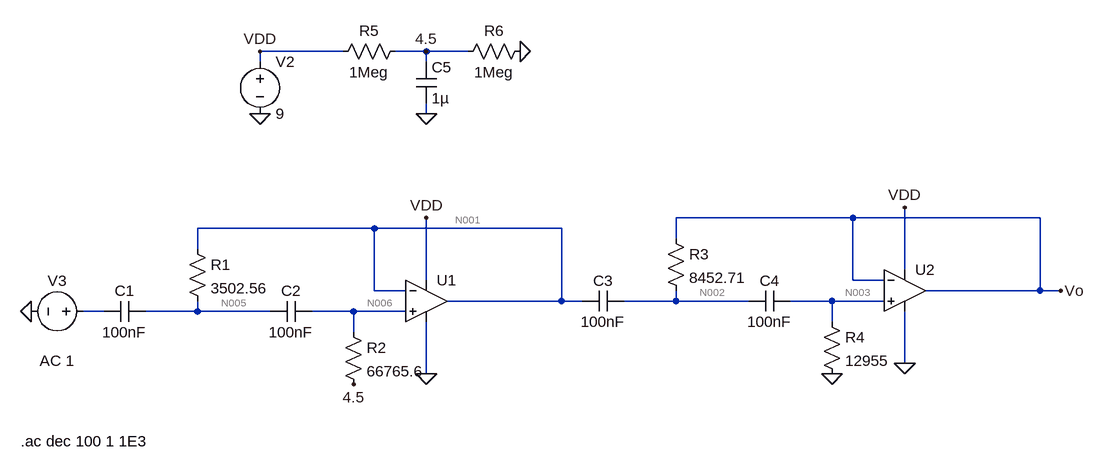
[diagram p0: schematic P1_409_Final.asc]
P1_409_Final.asc, the LTspice schematic file:
Version 4.1
SHEET 1 1188 680
WIRE -48 -240 -176 -240
WIRE 80 -240 32 -240
WIRE 144 -240 80 -240
WIRE -176 -224 -176 -240
WIRE 80 -224 80 -240
WIRE 80 -144 80 -160
WIRE 736 16 464 16
WIRE 1024 16 736 16
WIRE 0 32 -272 32
WIRE 288 32 0 32
WIRE 464 48 464 16
WIRE -272 64 -272 32
WIRE 816 96 816 0
WIRE 80 112 80 16
WIRE 736 112 736 16
WIRE 784 112 736 112
WIRE 0 128 0 32
WIRE 48 128 0 128
WIRE 1024 128 1024 16
WIRE 1024 128 848 128
WIRE 1056 128 1024 128
WIRE 288 144 288 32
WIRE 288 144 112 144
WIRE 320 144 288 144
WIRE 464 144 464 128
WIRE 464 144 384 144
WIRE 576 144 464 144
WIRE 704 144 640 144
WIRE 784 144 704 144
WIRE -416 160 -448 160
WIRE -272 160 -272 144
WIRE -272 160 -352 160
WIRE -160 160 -272 160
WIRE -32 160 -96 160
WIRE 48 160 -32 160
WIRE 704 176 704 144
WIRE -32 192 -32 160
WIRE 816 240 816 160
WIRE 80 256 80 176
FLAG -176 -144 0
FLAG -528 160 0
FLAG 816 240 0
FLAG 704 256 0
FLAG 80 256 0
FLAG 224 -240 0
FLAG 80 -144 0
FLAG 80 -240 4.5
FLAG -32 272 4.5
FLAG -176 -240 VDD
FLAG 80 16 VDD
FLAG 816 0 VDD
FLAG 1056 128 Vo
SYMBOL voltage -176 -240 R0
WINDOW 123 0 0 Left 0
WINDOW 39 0 0 Left 0
SYMATTR InstName V2
SYMATTR Value 9
SYMBOL cap -352 144 R90
WINDOW 0 0 32 VBottom 2
WINDOW 3 32 32 VTop 2
SYMATTR InstName C1
SYMATTR Value 100nF
SYMBOL res -288 48 R0
SYMATTR InstName R1
SYMATTR Value 3502.56
SYMBOL cap -96 144 R90
WINDOW 0 0 32 VBottom 2
WINDOW 3 32 32 VTop 2
SYMATTR InstName C2
SYMATTR Value 100nF
SYMBOL res -48 176 R0
SYMATTR InstName R2
SYMATTR Value 66765.6
SYMBOL voltage -432 160 R90
WINDOW 0 -32 56 VBottom 2
WINDOW 3 32 56 VTop 2
WINDOW 123 60 56 VTop 2
WINDOW 39 0 0 Left 0
SYMATTR InstName V3
SYMATTR Value ""
SYMATTR Value2 AC 1
SYMBOL OpAmps\\UniversalOpAmp2 80 144 R0
SYMATTR InstName U1
SYMBOL cap 384 128 R90
WINDOW 0 0 32 VBottom 2
WINDOW 3 32 32 VTop 2
SYMATTR InstName C3
SYMATTR Value 100nF
SYMBOL res 448 32 R0
SYMATTR InstName R3
SYMATTR Value 8452.71
SYMBOL cap 640 128 R90
WINDOW 0 0 32 VBottom 2
WINDOW 3 32 32 VTop 2
SYMATTR InstName C4
SYMATTR Value 100nF
SYMBOL res 688 160 R0
SYMATTR InstName R4
SYMATTR Value 12955
SYMBOL OpAmps\\UniversalOpAmp2 816 128 R0
SYMATTR InstName U2
SYMBOL res 48 -256 R90
WINDOW 0 0 56 VBottom 2
WINDOW 3 32 56 VTop 2
SYMATTR InstName R5
SYMATTR Value 1Meg
SYMBOL res 240 -256 R90
WINDOW 0 0 56 VBottom 2
WINDOW 3 32 56 VTop 2
SYMATTR InstName R6
SYMATTR Value 1Meg
SYMBOL cap 64 -224 R0
SYMATTR InstName C5
SYMATTR Value 1µ
TEXT -544 360 Left 2 !.ac dec 100 1 1E3

The netlist it stands for:
* P1_409_Final.asc
V2 VDD 0 9
C1 N005 N004 100nF
R1 N001 N005 3502.56
C2 N006 N005 100nF
R2 N006 4.5 66765.6
V3 N004 0 AC 1
X§U1 N006 N001 VDD 0 N001 level2 Avol=1Meg GBW=10Meg Slew=10Meg Ilimit=25m Rail=0 Vos=0 En=0 Enk=0 In=0 Ink=0 Rin=500Meg  ; pins In+ In- V+ V- OUT
C3 N002 N001 100nF
R3 Vo N002 8452.71
C4 N003 N002 100nF
R4 N003 0 12955
X§U2 N003 Vo VDD 0 Vo level2 Avol=1Meg GBW=10Meg Slew=10Meg Ilimit=25m Rail=0 Vos=0 En=0 Enk=0 In=0 Ink=0 Rin=500Meg  ; pins In+ In- V+ V- OUT
R5 4.5 VDD 1Meg
R6 0 4.5 1Meg
C5 4.5 0 1µ
.ac dec 100 1 1E3
.lib UniversalOpAmp2.lib
.backanno
.end

* Results of the author's LTspice run, read from the files saved beside the schematic
* Operating Point, zero values left out:
*   V(4.5) = 4.5 V
*   V(n001) = 4.5 V
*   V(n002) = 197 µV
*   V(n003) = 116.6 µV
*   V(n005) = 4.5 V
*   V(n006) = 4.5 V
*   V(vdd) = 9 V
*   V(vo) = 197 µV
*   I(R4) = 9 nA
*   I(R5) = -4.5 µA
*   I(R6) = -4.5 µA
*   I(V2) = -458.8 µA
*   Ix(u1:3) = 450 µA
*   Ix(u1:4) = -450 µA
*   Ix(u2:1) = -9 nA
*   Ix(u2:2) = -9 nA
*   Ix(u2:3) = 4.271 µA
*   Ix(u2:4) = -4.214 µA
*   Ix(u2:5) = 9 nA
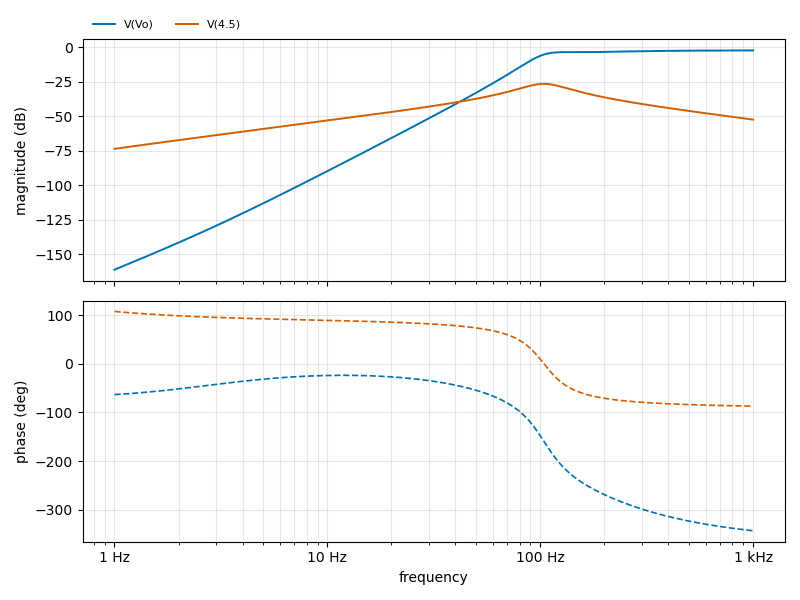
[diagram p1: AC Analysis of P1_409_Final.asc, plotted from the saved traces]
* AC Analysis, 1 run:
*   V(Vo): -161.14 dB at 1 Hz, -2.21 dB at 1 kHz, peak -2.21 dB at 1 kHz, 3 dB below the peak at 103.9 Hz
*   V(4.5): -73.57 dB at 1 Hz, -52.37 dB at 1 kHz, peak -26.45 dB at 104.7 Hz, 3 dB below the peak at 82 Hz and 132.1 Hz